# Altium schematic sheet SolarMppt.SchDoc
size 420 x 297 mm; SheetNumber: 2; SheetTotal: 21
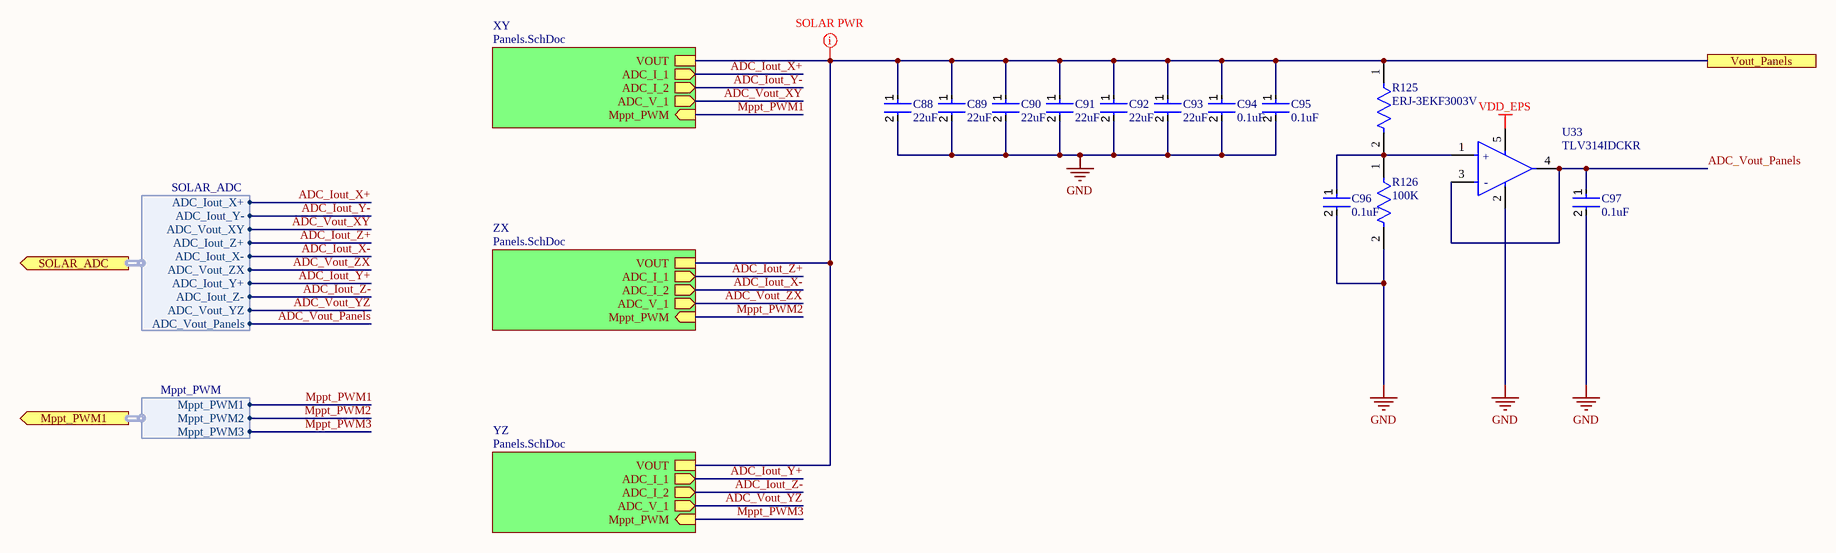
[diagram p0: SolarMppt.SchDoc]

## Parts
C88  22uF  [FP-GRM21B-0_2-e0_2_0_7-IPC_C]
C89  22uF  [FP-GRM21B-0_2-e0_2_0_7-IPC_C]
C90  22uF  [FP-GRM21B-0_2-e0_2_0_7-IPC_C]
C91  22uF  [FP-GRM21B-0_2-e0_2_0_7-IPC_C]
C92  22uF  [FP-GRM21B-0_2-e0_2_0_7-IPC_C]
C93  22uF  [FP-GRM21B-0_2-e0_2_0_7-IPC_C]
C94  0.1uF  [FP-C0603C-CF-MFG]
C95  0.1uF  [FP-C0603C-CF-MFG]
C96  0.1uF  [FP-C0603C-CF-MFG]
C97  0.1uF  [FP-C0603C-CF-MFG]
R125  ERJ-3EKF3003V  [FP-ERJ3EK-MFG]
R126  100K  [FP-ERA3A-MFG]
U33  TLV314IDCKR  [FP-DCK0005A-MFG]

## Sub-sheets
XY = Panels.SchDoc: ADC_I_1 (out), ADC_I_2 (out), ADC_V_1 (out), Mppt_PWM (in), VOUT
YZ = Panels.SchDoc: ADC_I_1 (out), ADC_I_2 (out), ADC_V_1 (out), Mppt_PWM (in), VOUT
ZX = Panels.SchDoc: ADC_I_1 (out), ADC_I_2 (out), ADC_V_1 (out), Mppt_PWM (in), VOUT

## Ports
Mppt_PWM1 (out, harness Mppt_PWM), SOLAR_ADC (out, harness SOLAR_ADC), Vout_Panels

## Harnesses
SOLAR_ADC: ADC_Iout_X+, ADC_Iout_Y-, ADC_Vout_XY, ADC_Iout_Z+, ADC_Iout_X-, ADC_Vout_ZX, ADC_Iout_Y+, ADC_Iout_Z-, ADC_Vout_YZ, ADC_Vout_Panels
Mppt_PWM: Mppt_PWM1, Mppt_PWM2, Mppt_PWM3

## Nets
GND: C88.2 C89.2 C90.2 C91.2 C92.2 C93.2 C94.2 C95.2 C96.2 C97.2 R126.2 U33.2(V-)
VDD_EPS: U33.5(V+)
ADC_Iout_X+: sheet XY/ADC_I_1, port SOLAR_ADC.ADC_Iout_X+
ADC_Iout_X-: sheet ZX/ADC_I_2, port SOLAR_ADC.ADC_Iout_X-
ADC_Iout_Y+: sheet YZ/ADC_I_1, port SOLAR_ADC.ADC_Iout_Y+
ADC_Iout_Y-: sheet XY/ADC_I_2, port SOLAR_ADC.ADC_Iout_Y-
ADC_Iout_Z+: sheet ZX/ADC_I_1, port SOLAR_ADC.ADC_Iout_Z+
ADC_Iout_Z-: sheet YZ/ADC_I_2, port SOLAR_ADC.ADC_Iout_Z-
ADC_Vout_Panels: C97.1 U33.3(-IN) U33.4(OUT) ; port SOLAR_ADC.ADC_Vout_Panels
ADC_Vout_XY: sheet XY/ADC_V_1, port SOLAR_ADC.ADC_Vout_XY
ADC_Vout_YZ: sheet YZ/ADC_V_1, port SOLAR_ADC.ADC_Vout_YZ
ADC_Vout_ZX: sheet ZX/ADC_V_1, port SOLAR_ADC.ADC_Vout_ZX
Mppt_PWM1: sheet XY/Mppt_PWM, port Mppt_PWM1.Mppt_PWM1
Mppt_PWM2: sheet ZX/Mppt_PWM, port Mppt_PWM1.Mppt_PWM2
Mppt_PWM3: sheet YZ/Mppt_PWM, port Mppt_PWM1.Mppt_PWM3
Vout_Panels: C88.1 C89.1 C90.1 C91.1 C92.1 C93.1 C94.1 C95.1 R125.1 ; port Vout_Panels, sheet XY/VOUT, sheet ZX/VOUT, sheet YZ/VOUT
NetC96_1: C96.1 R125.2 R126.1 U33.1(+IN)

## Layout directives
net class SOLAR PWR: Vout_Panels

## Notes on the sheet
- THIS DOCUMENT AND THE DATA DISCLOSED HEREIN OR
- HEREWITH IS THE PROPERTY OF ALTIUM LIMITED AND MAY
- DWG NO:
- REVISION
- REV:
- DESCRIPTION
- DATE
- APPROVED
- BE FREELY DISTRIBUTED IN WHOLE. NO RIGHTS ARE
- RESERVED OR EXPRESS OR IMPLIED WARANTEE GIVEN.
- ENG:
- APPROVALS
- PROJECT
- DSN:
- CHK:
- REFERENCE DOCUMENTS
- PROJECT REVISION:
- TITLE
- DOCUMENT REVISION:
- DESIGN ITEM:
- BOM:
- FAB DWG:
- PCB DWG:
- ASSY DWG:
- SCALE:
- A3
- SIZE
- CAGE CODE
- FILE NAME
- DWG NO.
- SHEET
- OF
- REV
- (in symbol CMP-04895-000170-1) +; -

## Library data of the parts
C88-C93 = CMP-06035-025845-1: Chip Multilayer Ceramic Capacitors for General Purpose, 0805, 22uF, X7T, +22%/-33%, 20%, 10V; Dissipation Factor: 0.035%; Height: 1.25mm; Min Operating Temperature: -55°C; Case/Package: 0805; Packaging: Tape and Reel; Voltage: 10V; Depth: 1.25mm; Width: 1.25mm; Voltage Rating: 10V; Dielectric: X7T; Weight: 0.000335oz; Capacitance: 22uF; Mount: Surface Mount; Package Quantity: 3000; Lead Free: Lead Free; Tolerance: 20%; Thickness: 0.057inch; Max Operating Temperature: 125°C; Length: 2mm; Material: Ceramic; Case Code (Metric): 2012; Termination: SMD/SMT; Voltage Rating (DC): 10V; Dielectric Material: Ceramic; Case Code (Imperial): 0805
C94 C95 = CMP-2006-03054-2: CAP CER 0.1UF 16V X7R 0603; Manufacturer: KEMET; Manufacturer Part Number: C0603C104J4RACTU; Material: Ceramic; Capacitance: 0.10 μF; Tolerance: 0.05; Automotive Grade: Grade 1; Value: 0.10 μF; Temperature Coefficient: 30ppm/°C; Digikey Description: CAP CER 0.1UF 16V X7R 0603; Automotive: Yes; Octopart: https://octopart.com/c0603c104j4ractu-kemet-102515; Device Class L2: Capacitors; Temperature Characteristic: X7R; Category: Cap; Mouser Description: Cap Ceramic 0.1uF 16V X7R 5% SMD 0603 125°C Paper T/R; Voltage Rating: 16 V; Temperature Range Low: -55°C; Device Class L1: Passive Components; ComponentLink2URL: https://api.kemet.com/component-edge/download/datasheet/C0603C100J5GACAUTO.pdf; Lead Free: Yes; Temperature Range High: +125°C; Height: 0.87mm; Device Class L3: Ceramic Capacitors; ComponentLink2Description: Datasheet; Package: C0603C-CF; RoHS: TRUE; Temperature: -55°C to +125°C
C96 C97 = CMP-2006-03061-2: CAP CER 0.1UF 50V X7R 0603; Manufacturer: KEMET; Manufacturer Part Number: C0603C104K5RACTU; Tolerance: 0.1; Temperature Coefficient: 30ppm/°C; Material: Ceramic; Automotive Grade: Grade 1; Value: 0.10 μF; Temperature: -55°C to +125°C; RoHS: TRUE; Temperature Range High: +125°C; Lead Free: Yes; Octopart: https://octopart.com/c0603c104k5ractu-kemet-139244; Digikey Description: CAP CER 0.1UF 50V X7R 0603; Category: Cap; Package: C0603C-CF; ComponentLink2Description: Datasheet; Temperature Range Low: -55°C; Device Class L1: Passive Components; Voltage Rating: 50 V; Automotive: Yes; Device Class L3: Ceramic Capacitors; ComponentLink2URL: https://api.kemet.com/component-edge/download/datasheet/C0603C100J5GACAUTO.pdf; Capacitance: 0.10 μF; Device Class L2: Capacitors; Temperature Characteristic: X7R; Height: 0.87mm
R125 = CMP-2000-00414-2: NexarPartId: 41621939; Resistance: 300kΩ; Max Power Dissipation: 100mW; Voltage Rating: 75V; Tolerance: 1%; Temperature Coefficient: 100ppm/°C; Military Standard: Not; Number of Terminations: 2; Termination: SMD/SMT; RoHS: Compliant; Min Operating Temperature: -55°C; Schedule B: 8533210045, 8533210045; Height: 558.8µm; REACH SVHC: No SVHC; Case/Package: 0603; Lead Free: Lead Free; Case Code (Imperial): 0603; Case Code (Metric): 1608; Depth: 800µm; Composition: Thick Film; Mount: Surface Mount; Radiation Hardening: No; Features: Automotive AEC-Q200; Width: 787.4µm; Packaging: Cut Tape; Contact Plating: Tin; Length: 1.6mm; Power Rating: 100mW; Lifecycle Status: Production; Voltage Rating (DC): 75V; Max Operating Temperature: 155°C
R126 = CMP-2000-00875-2: NexarPartId: 1243428; Power Rating: 100mW; Voltage Rating (DC): 75V; Tolerance: 0.1%; Temperature Coefficient: 25ppm/°C; Resistance: 100kΩ; Contact Plating: Tin; Max Operating Temperature: 155°C; Case Code (Imperial): 0603; Packaging: Cut Tape; Width: 800µm; Lead Free: Lead Free; REACH SVHC: No SVHC; Termination: SMD/SMT; Radiation Hardening: No; Length: 1.6mm; Military Standard: Not; Features: Automotive AEC-Q200; Case/Package: 0603; Number of Terminations: 2; Composition: Thin Film; Schedule B: 8533210045, 8533210045; Voltage Rating: 75V; Mount: Surface Mount; Case Code (Metric): 1608; Lifecycle Status: Production; Height: 450µm; RoHS: Compliant; Number of Pins: 2; Max Power Dissipation: 100mW; Min Operating Temperature: -55°C; Depth: 800µm; Working Voltage: 75V
U33 = CMP-04895-000170-1: IC CMOS 1 CIRCUIT SC70-5; Gain Bandwidth Product: 3MHz; Number of Channels: 1; Lead Free: Lead Free; Min Operating Temperature: -40°C; RoHS Compliant: Yes; Max Operating Temperature: 125°C; Number of Pins: 5